# EAGLE design fastedge (EAGLE 9.2.2)
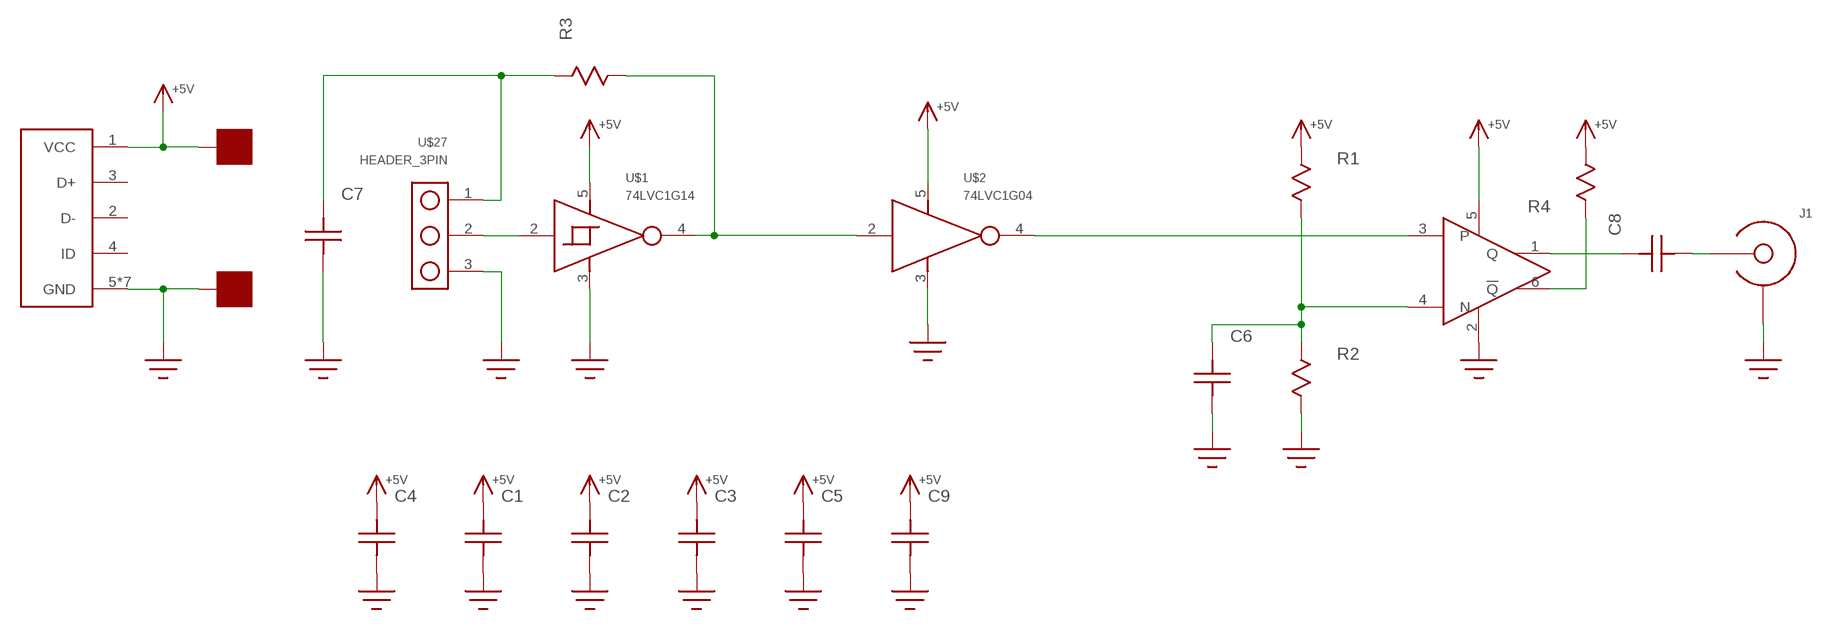
[diagram p0: schematic, sheet 1]

## Parts
C1  C0603  [C0603]
C2  C0603  [C0603]
C3  C0603  [C0603]
C4  C0805  [0805]
C5  C0402_NO_THERMALS  [C0402_NO_THERMALS]
C6  C0603  [C0603]
C7  C0603  [C0603]
C8  C0402_NO_THERMALS  [C0402_NO_THERMALS]
C9  C0402_NO_THERMALS  [C0402_NO_THERMALS]
IC1  ADCMP606  [SC70-6]
J1  BNC_MALE_PCB  [BNC_MALE_PCB]
R1  R0603  [R0603]
R2  R0603  [R0603]
R3  R0603  [R0603]
R4  R0402  [0402]
U$1  74LVC1G14  [SOT23-5]
U$2  74LVC1G04  [SOT23-5]
U$13  USB_JACK  [FCI_MICRO_USB]
U$27  HEADER_3PIN  [HEADER_3PIN]
U$32  PAD50MIL  [PAD_50MIL]
U$33  PAD50MIL  [PAD_50MIL]

## Nets
+5V: C1.P$2 C2.P$2 C3.P$2 C4.P$2 C5.2 C9.2 IC1.5(VCC) R1.P$1 R4.2 U$1.5(VCC) U$2.5(VCC) U$13.1(VCC) U$32.P$1
GND: C1.P$1 C2.P$1 C3.P$1 C4.P$1 C5.1 C6.P$1 C7.P$1 C9.1 IC1.2(VEE) J1.SHIELD@1(SHIELD) J1.SHIELD@2(SHIELD) J1.SHIELD@3(SHIELD) J1.SHIELD@4(SHIELD) R2.P$2 U$1.3(GND) U$2.3(GND) U$13.5(GND) U$13.GND1(GND) U$13.GND2(GND) U$13.GND3(GND) U$13.GND4(GND) U$13.GND5(GND) U$13.GND6(GND) U$27.3 U$33.P$1
N$1: C6.P$2 IC1.4(N) R1.P$2 R2.P$1
N$2: C7.P$2 R3.P$1 U$27.1
N$3: IC1.3(P) U$2.4(OUT)
N$4: R3.P$2 U$1.4(OUT) U$2.2(IN)
N$5: U$1.2(IN) U$27.2
N$6: C8.2 IC1.1(Q)
N$8: IC1.6(!Q!) R4.1
N$10: C8.1 J1.CENTER
Unconnected: U$13.2(D-) U$13.3(D+) U$13.4(ID)

## Library data of the parts
C1-C9 = yapo:C
IC1 = yapo:ADCMP606
J1 = yapo:BNC_MALE_PCB
R1-R4 = yapo:R
U$1 = yapo:74LVC1G14
U$2 = yapo:74LVC1G04
U$13 = yapo:USB_JACK
U$27 = yapo:HEADER_3PIN
U$32 U$33 = yapo:PAD

## Board
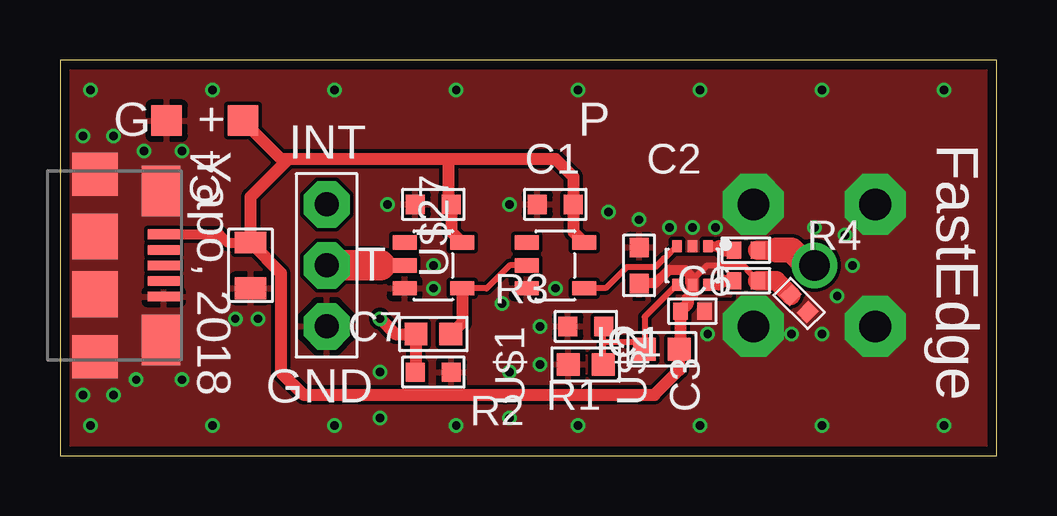
[diagram p1: board, top side]
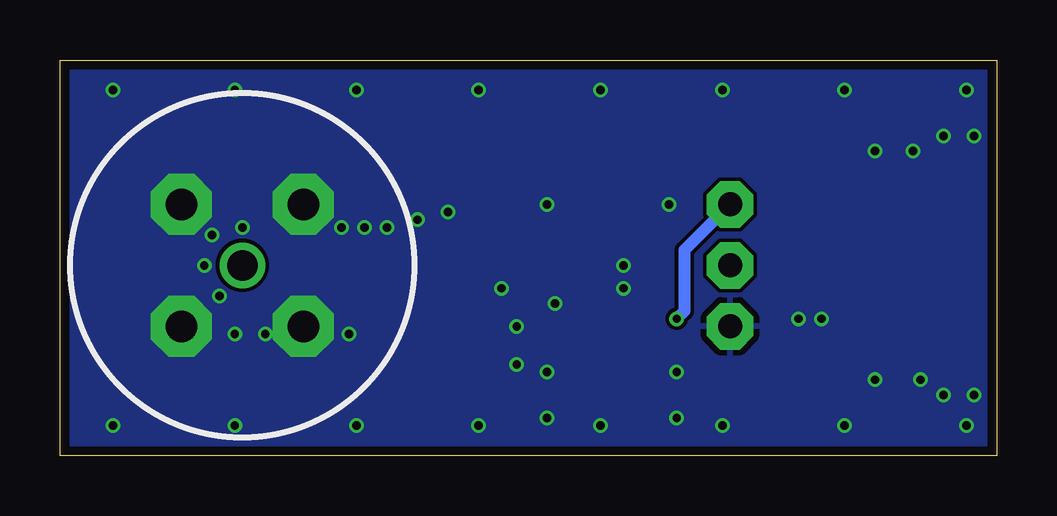
[diagram p2: board, bottom side, seen from below]

Size 39.03 x 16.5 mm. Coordinates in mm from the lower left corner, seen from the top.
Outline: 0,0 39.03,0 39.03,16.5 0,16.5 0,0
Copper layers (1*16): Top 0.035559375mm / dielectric 1.6mm / Bottom 0.035559375mm
Design rules "oshpark-2layer *": minimum track width 6mil, minimum drill 10mil, track to track 6mil, track to pad 6mil, pad to pad 6mil, via to via 6mil, smd to smd 6mil, copper to edge 15mil, drill to drill 6mil, minimum pad ring 5mil, minimum via ring 5mil, stop-mask expansion 2.5mil, vias tented up to drill 20mil, thermal gap 10mil

### Footprints (pad centres in the part's own frame; a part is rotated, then mirrored left to right if it is on the bottom)
C0603 = smd 0.8 x 0.8: P$1 -0.75,0; P$2 0.75,0
0805 = smd 0.9 x 1.3: P$1 -0.95,0; P$2 0.95,0
C0402_NO_THERMALS = smd 0.6 x 0.7: 1 -0.5,0; 2 0.5,0
SC70-6 = smd 0.4 x 0.5: 1 -0.65,-0.8; 2 0,-0.8; 3 0.65,-0.8; 4 0.65,0.8; 5 0,0.8; 6 -0.65,0.8
BNC_MALE_PCB = drill 1.27 pad 1.778: CENTER 0,0 | drill 1.321 pad 2.54 octagon: SHIELD@1 -2.54,-2.54; SHIELD@2 -2.54,2.54; SHIELD@3 2.54,2.54; SHIELD@4 2.54,-2.54
R0603 = smd 0.95 x 0.95: P$1 -0.725,0; P$2 0.725,0
0402 = smd 0.6 x 0.7: 1 -0.5,0; 2 0.5,0
SOT23-5 = smd 0.6 x 1: 1 -0.95,-1.2; 2 0,-1.2; 3 0.95,-1.2; 4 0.95,1.2; 5 -0.95,1.2
FCI_MICRO_USB = smd 0.4 x 1.35: 1 -1.3,4.325; 2 -0.65,4.325; 3 0,4.325; 4 0.65,4.325; 5 1.3,4.325 | smd 1.8 x 1.9: GND1 -3.8,1.45; GND4 3.8,1.45 | smd 1.9 x 1.9: GND2 -1.2,1.45; GND3 1.2,1.45 | smd 2.1 x 1.6: GND5 -3.1,4.2; GND6 3.1,4.2
HEADER_3PIN = drill 1 pad 1.93 octagon: 1 -2.54,0; 2 0,0; 3 2.54,0
PAD_50MIL = smd 1.27 x 1.27: P$1 0,0

### Placement (x,y rotation side)
C1  15.56,10.48 0 top
C2  20.64,10.48 0 top
C3  24.13,7.94 270 top
C4  7.94,7.94 90 top
C5  26.35,6.03 180 top
C6  21.91,5.4 0 top
C7  15.56,3.49 180 top
C8  28.57,8.57 180 top
C9  30.8,6.35 135 top
IC1  26.35,7.94 180 top
J1  31.43,7.94 0 top
R1  25.08,4.45 180 top
R2  21.91,3.81 180 top
R3  15.56,5.08 0 top
R4  28.57,7.3 0 top
U$1  15.56,7.94 270 top
U$2  20.64,7.94 270 top
U$13  0,7.94 270 top
U$27  11.11,7.94 270 top
U$32  7.62,13.97 0 top
U$33  4.45,13.97 0 top

### Tracks (layer width: path | path; a pad name or v marks a point on that pad's centre or on a via)
+5V
  Top 0.254: IC1.5 26.47,7.25 26.47,7.45 26.95,7.93 28.49,7.93 28.65,7.77 28.65,7.72 R4.2
  Top 0.406: C4.P$2 6.99,8.89 6.64,9.24 U$13.1 | C3.P$2 24.8,7.19 25.36,7.74 26.05,7.74 26.26,7.54 26.26,7.23 IC1.5
  Top 0.508: U$2.5 21.39,9.34 C2.P$2 21.39,11.63 20.64,12.38 16.19,12.38 | U$1.5 16.31,9.34 C1.P$2 16.19,10.59 16.19,12.38 | 9.53,12.38 7.94,10.79 C4.P$2 9.21,7.62 9.21,3.49 10.16,2.54 24.77,2.54 25.81,3.58 R1.P$1 25.85,4.49 C5.2 26.15,6.33 26.15,6.55 26.35,6.76 IC1.5 | 9.53,12.38 16.19,12.38 | U$32.P$1 9.21,12.38 9.53,12.38
  Top 0.813: C9.2 29.84,7.3 R4.2
  pour Top: 23.81,8.26 27.94,8.26 27.94,6.67 23.73,6.67 24.09,7.02 23.81,7.3
GND  (via drill 0.35)
  other vias: 26.35,9.53 24.13,9.84 20,5.4 20,3.81 20.64,6.99 15.56,6.99 13.65,10.48 18.73,10.48 15.56,7.94 7.3,5.71 8.26,5.71 0.95,2.54 2.22,2.54 0.95,13.34 2.22,13.34 3.49,12.7 5.08,12.7 3.17,3.17 5.08,3.17 13.34,3.49 13.34,1.59 18.73,3.49 18.73,1.59 18.41,6.35 26.99,5.08 1.27,15.24 6.35,15.24 11.43,15.24 16.51,15.24 21.59,15.24 26.67,15.24 31.75,15.24 36.83,15.24 36.83,1.27 31.75,1.27 26.67,1.27 21.59,1.27 16.51,1.27 11.43,1.27 6.35,1.27 1.27,1.27 22.86,10.16 31.75,5.08 31.43,9.53 33.02,7.94 32.38,6.67 32.7,9.21 30.48,5.08 25.4,9.53 27.3,9.53
  pour Top (rank 2): 0,16.51 39.05,16.51 39.05,0 0,0
  pour Bottom: 0,16.51 39.05,16.51 39.05,0 0,0
N$1
  Top 0.254: IC1.4 24.36,5.79 R1.P$2 24.04,4.76 22.63,4.76 | R2.P$1 22.63,4.76 | 22.63,4.76 22.63,5.37 C6.P$2
N$2  (via drill 0.35)
  Top 0.254: 14.83,3.52 C7.P$2
  Top 0.508: v13.34,5.71 13.97,5.08 R3.P$1 14.83,3.52
  Bottom 0.508: U$27.1 13.02,8.57 13.02,6.03 v13.34,5.71
N$3
  Top 0.254: IC1.3 25.19,8.23 25.16,8.23 24.8,7.87 23.61,7.87 22.73,6.99 U$2.4
N$4
  Top 0.254: U$2.2 18.73,7.94 17.78,6.99 U$1.4
  Top 0.508: U$1.4 16.76,5.55 R3.P$2
N$5
  Top 0.254: U$1.2 13.34,7.94
  Top 1.27: 13.34,7.94 U$27.2
N$6
  Top 0.406: IC1.1 27.46,8.74
  Top 0.508: 27.46,8.74 27.62,8.57 C8.2
N$8
  Top 0.406: IC1.6 27.46,7.14
  Top 0.508: 27.46,7.14 27.62,7.3 R4.1
N$10
  Top 0.813: 29.84,8.57 C8.1
  Top 1.041: J1.CENTER 31.11,7.94 30.48,8.57 29.84,8.57

### Text on the board
tPlace: G | + | Yapo, 2018 | P | FastEdge | INT | T | GND